# EAGLE design ESP Breakout Adapter - v3.1A - AS1363 - Mini (EAGLE 7.3.0)
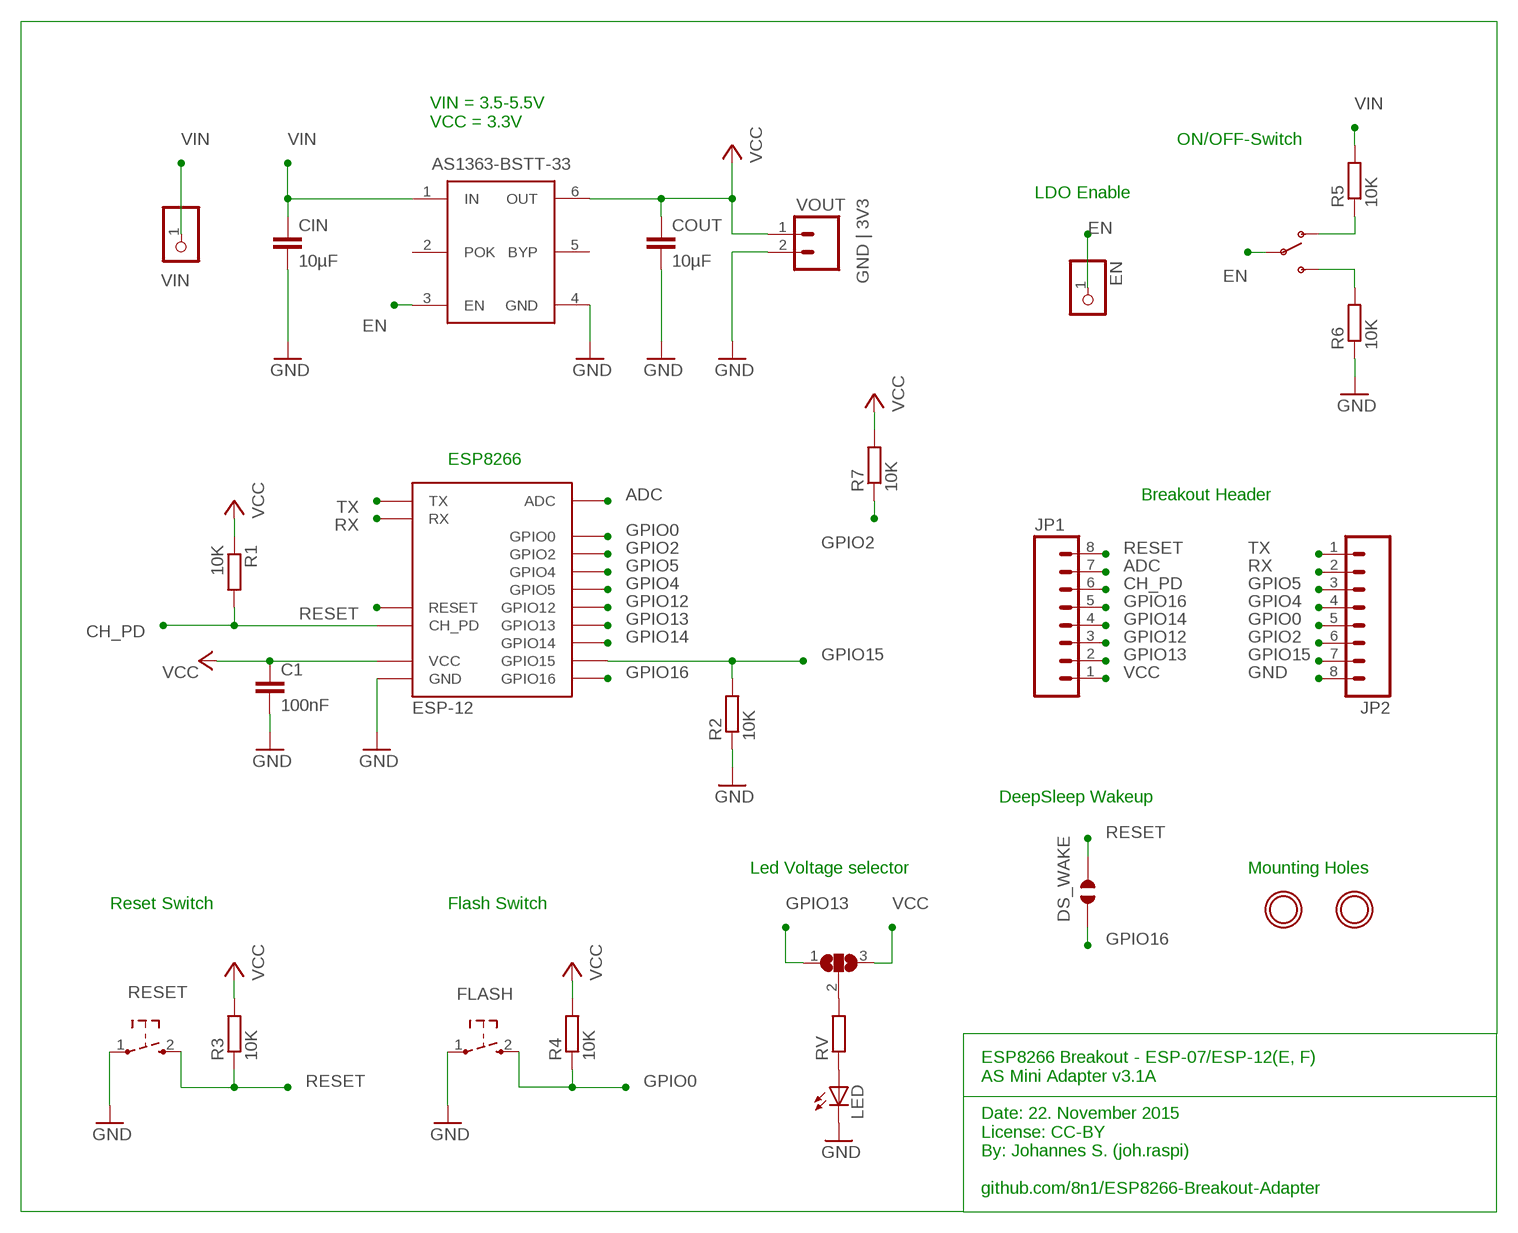
[diagram p0: schematic, sheet 1]

## Parts
AS1363-BSTT-33  AS1363  [SOT23-6]
C1  100nF  C-EUC0805  [C0805]
CIN  10µF  C-EUC0805  [C0805]
COUT  10µF  C-EUC0805  [C0805]
DS_WAKE  JUMPER_SOLDER_1X2  [JUMPER_SOLDER_1X2]
EN  PINHD-1X1  [1X01]
FLASH  SW_TACT_2P-3X6  [SW_TACT_3X6]
JP1  M081X08  [1X08]
JP2  M081X08  [1X08]
LED  LEDCHIPLED_0805  [CHIPLED_0805]
LED_VOLTAGE  SJ2W  [SJ_2]
ON/OFF-SWITCH  SWITCH_SPDT  [KPS-1290]
R1  10K  R-EU_R0805  [R0805]
R2  10K  R-EU_R0805  [R0805]
R3  10K  R-EU_R0805  [R0805]
R4  10K  R-EU_R0805  [R0805]
R5  10K  R-EU_R0805  [R0805]
R6  10K  R-EU_R0805  [R0805]
R7  10K  R-EU_R0805  [R0805]
RESET  SW_TACT_2P-3X6  [SW_TACT_3X6]
RV  R-EU_R0805  [R0805]
U$1  ESP-12  [ESP-12]
U$4  MOUNTINGHOLE2.0  [MOUNTINGHOLE_2.0_PLATED]
U$5  MOUNTINGHOLE2.0  [MOUNTINGHOLE_2.0_PLATED]
VIN  M01PTH_2MM  PINHD-1X1CB  [1X01-CLEANBIG]
VOUT  GND | 3V3  M02PTH  [1X02]

## Nets
123: ON/OFF-SWITCH.S R6.2
ADC: JP1.7 U$1.ADC
CH_PD: JP1.6 R1.2 U$1.CH_PD
EN: AS1363-BSTT-33.3(EN) EN.1 ON/OFF-SWITCH.P
GND [a]: AS1363-BSTT-33.4(GND) C1.2 CIN.2 COUT.2 FLASH.1 JP2.8 LED.C R2.1 R6.1 RESET.1 U$1.GND VOUT.2
GPIO0: FLASH.2 JP2.5 R4.1 U$1.GPIO0
GPIO2: JP2.6 R7.1 U$1.GPIO2
GPIO4: JP2.4 U$1.GPIO5
GPIO5: JP2.3 U$1.GPIO4
GPIO12: JP1.3 U$1.GPIO12
GPIO13: JP1.2 LED_VOLTAGE.1 U$1.GPIO13
GPIO14: JP1.4 U$1.GPIO14
GPIO15: JP2.7 R2.2 U$1.GPIO15
GPIO16: DS_WAKE.1 JP1.5 U$1.GPIO16
N$2: LED_VOLTAGE.2 RV.2
N$3: ON/OFF-SWITCH.O R5.1
N$5: LED.A RV.1
RESET: DS_WAKE.2 JP1.8 R3.1 RESET.2 U$1.RESET
RX: JP2.2 U$1.RX
TX: JP2.1 U$1.TX
VCC: AS1363-BSTT-33.6(OUT) C1.1 COUT.1 JP1.1 LED_VOLTAGE.3 R1.1 R3.2 R4.2 R7.2 U$1.VCC VOUT.1
VIN: AS1363-BSTT-33.1(IN) CIN.1 R5.2 VIN.1
Unconnected: AS1363-BSTT-33.2(POK)

## Notes on the sheet
- VIN = 3.5-5.5V
  VCC = 3.3V
- ON/OFF-Switch
- LDO Enable
- ESP8266
- Breakout Header
- DeepSleep Wakeup
- Led Voltage selector | Mounting Holes
- Reset Switch | Flash Switch
- ESP8266 Breakout - ESP-07/ESP-12(E, F)
  AS Mini Adapter v3.1A
  
  Date: 22. November 2015
  License: CC-BY
  By: Johannes S. (joh.raspi)
  
  github.com/8n1/ESP8266-Breakout-Adapter

## Power pins joined to a net without a drawn wire
BYP: AS1363-BSTT-33.5(BYP)

## Library data of the parts
AS1363-BSTT-33 = joh_as1363:AS1363: 500mA ultra-low-dropout linear regulator 1.2V-5V 40µA quiescen current Source: http://ams.com/eng/content/download/12507/219217/12422
C1 CIN COUT = resistor:C-EU: CAPACITOR, European symbol
DS_WAKE = dp-devices:JUMPER_SOLDER_1X2
EN = pinhead:PINHD-1X1: PIN HEADER
FLASH RESET = dp-devices:SW_TACT_2P
JP1 JP2 = SparkFun:M08: Header 8 Standard 8-pin 0.1" header. Use with straight break away headers (SKU : PRT-00116), right angle break away headers (PRT-00553), swiss pins (PRT-00743), machine pins (PRT-00117), and female headers (PRT-00115).
LED = adafruit:LED: LED OSRAM: - CHIPLED LG R971, LG N971, LY N971, LG Q971, LY Q971, LO R971, LY R971 LH N974, LH R974 LS Q976, LO Q976, LY Q976 LO Q996 - Hyper CHIPLED LW Q18S LB Q993, LB Q99A, LB R99A - SideLED LS A670, LO A670, LY A670, LG A670, LP A670 LB A673, LV A673, LT A673, LW A673 LH A674 LY A675 LS A676, LA A676, LO A676, LY A676, LW A676 LS A679, LY A679, LG A679 - Hyper Micro SIDELED® LS Y876, LA Y876, LO Y876, LY Y876 LT Y87S - SmartLED LW L88C, LW L88S LB L89C, LB L89S, LG L890 LS L89K, LO L89K, LY L89K LS L896, LA L896, LO L896, LY L896 - TOPLED LS T670, LO T670, LY T670, LG T670, LP T670 LSG T670, LSP T670, LSY T670, LOP T670, LYG T670 LG T671, LOG T671, LSG T671 LB T673, LV T673, LT T673, LW T673 LH T674 LS T676, LA T676, LO T676, LY T676, LB T676, LH T676, LSB T676, LW T676 LB T67C, LV T67C, LT T67C, LS T67K, LO T67K, LY T67K, LW E67C LS E67B, LA E67B, LO E67B, LY E67B, LB E67C, LV E67C, LT E67C LW T67C LS T679, LY T679, LG T679 LS T770, LO T770, LY T770, LG T770, LP T770 LB T773, LV T773, LT T773, LW T773 LH T774 LS E675, LA E675, LY E675, LS T675 LS T776, LA T776, LO T776, LY T776, LB T776 LHGB T686 LT T68C, LB T68C - Hyper Mini TOPLED® LB M676 - Mini TOPLED Santana® LG M470 LS M47K, LO M47K, LY M47K Source: http://www.osram.convergy.de/
LED_VOLTAGE = jumper:SJ2W: SMD solder JUMPER
ON/OFF-SWITCH = SparkFun-Electromechanical:SWITCH_SPDT: SWCH-10651 Side-actuated SPDT slide switch, as used on the Arduino Pro; PROD_ID: SWCH-10651
R1-R4 R7 = rcl:R-EU_: RESISTOR, European symbol
R5 R6 RV = resistor:R-EU_: RESISTOR, European symbol
U$1 = johs_esp8266_lib_frank_esp12e_mod:ESP-12: ESP8266 Wifi Module ESP-12; DIMENSIONS: 24.0 x 16.0 mm; PINS: 16; PITCH: 0.078" / 2 mm
U$4 U$5 = microbuilder:MOUNTINGHOLE: Mounting Hole For #2 screws (0.086"/2.18mm width, 0.094"/2.4mm hole) use 2.5mm
VIN = adafruit:PINHD-1X1: Pin header 1x1 for 0.1" spacing With round pins
VOUT = SparkFun:M02: Header 2 Standard 2-pin 0.1" header. Use with straight break away headers (SKU : PRT-00116), right angle break away headers (PRT-00553), swiss pins (PRT-00743), machine pins (PRT-00117), and female headers (PRT-00115). Molex polarized connector foot print use with SKU : PRT-08233 with associated crimp pins and housings.

## Net classes
1 a: width 0.203 mm, drill 0.305 mm, clearance 0.203 mm

## Board
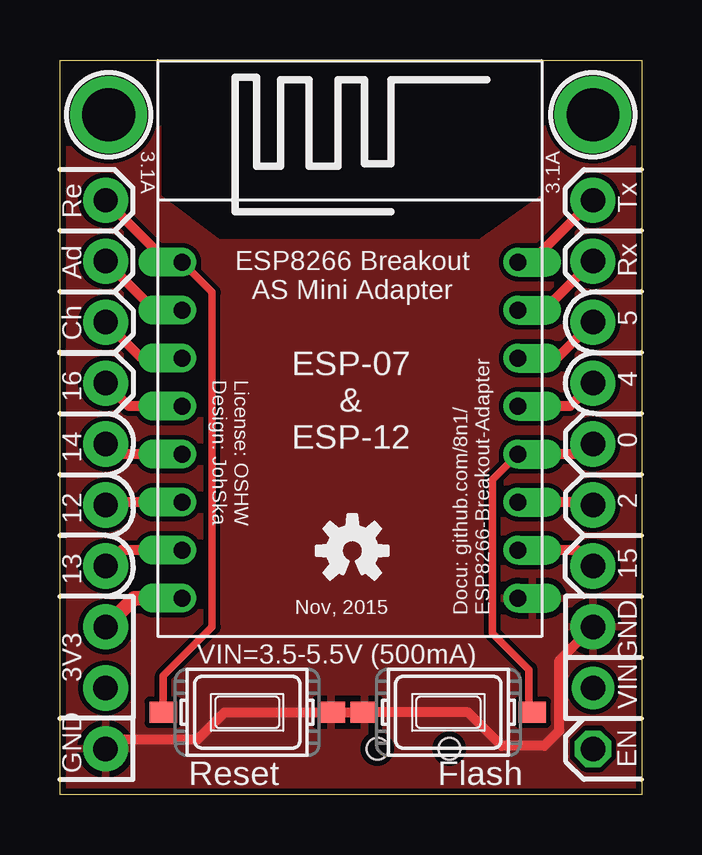
[diagram p1: board, top side]
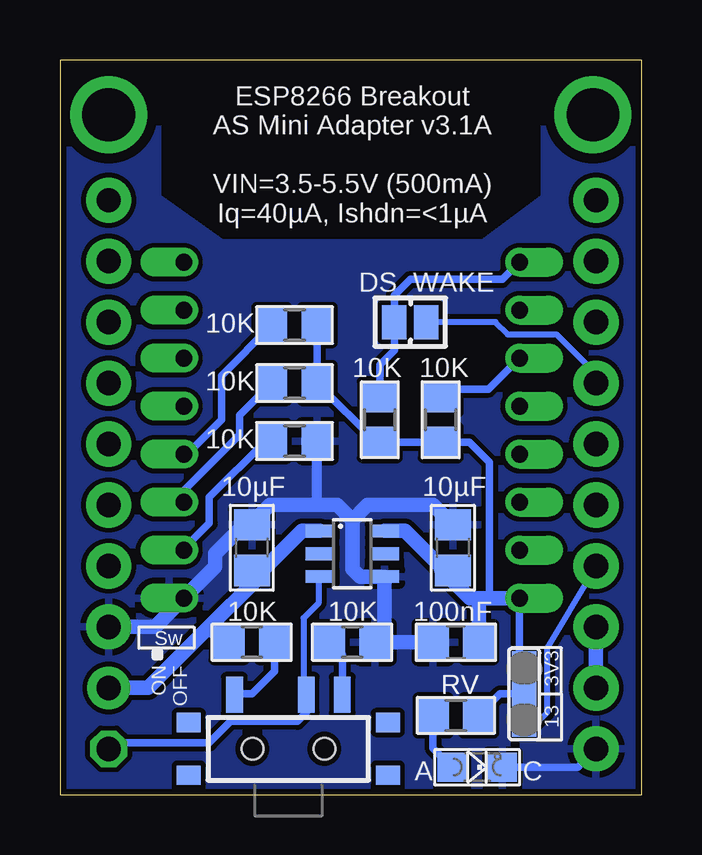
[diagram p2: board, bottom side, seen from below]

Size 24.26 x 30.61 mm. Coordinates in mm from the lower left corner, seen from the top.
Outline: 0,0 0,30.61 24.26,30.61 24.26,0 0,0
Copper layers (1*16): Top 0.035mm / dielectric 1.5mm / Bottom 0.035mm
Design rules "adafruit": minimum track width 10mil, minimum drill 15.5mil, track to track 8mil, track to pad 8mil, pad to pad 8mil, via to via 8mil, smd to smd 8mil, copper to edge 10mil, drill to drill 8mil, minimum pad ring 10mil, minimum via ring 8mil, stop-mask expansion 2mil, vias tented up to drill 20mil, thermal gap 10mil

### Footprints (pad centres in the part's own frame; a part is rotated, then mirrored left to right if it is on the bottom)
SOT23-6 = smd 0.533 x 1.219: 1 -0.95,-1.341; 2 0,-1.341; 3 0.95,-1.341; 4 0.95,1.341; 5 0,1.341; 6 -0.95,1.341
C0805 = smd 1.3 x 1.5: 1 -0.95,0; 2 0.95,0
JUMPER_SOLDER_1X2 = smd 1.016 x 1.422: 1 -0.66,0; 2 0.66,0
1X01 = drill 1.016 octagon: 1 0,0
SW_TACT_3X6 = smd 1.143 x 0.889: 1 -3.5,0; 2 3.5,0
1X08 = drill 1.016 pad 1.88: 1 0,0; 2 2.54,0; 3 5.08,0; 4 7.62,0; 5 10.16,0; 6 12.7,0; 7 15.24,0; 8 17.78,0
CHIPLED_0805 = smd 1.2 x 1.2: A 0,-1.05; C 0,1.05
SJ_2 = smd 1.016 x 1.016: 1 -1.27,0; 2 0,0; 3 1.27,0
KPS-1290 = smd 0.7 x 1.5: O -2.25,2.25; P 0.75,2.25; S 2.25,2.25 | smd 1 x 0.8: P$1 -4.15,1.1; P$2 -4.15,-1.1; P$3 4.15,-1.1; P$4 4.15,1.1 | hole 0.9: -1.5,0; 1.5,0
R0805 = smd 1.3 x 1.5: 1 -0.95,0; 2 0.95,0
ESP-12 = drill 0.7 offset: ADC -7.1,3.8; CH_PD -7.1,1.8; GND 6.9,-8.2; GPIO0 6.9,-2.2; GPIO2 6.9,-4.2; GPIO4 6.9,1.8; GPIO5 6.9,-0.2; GPIO12 -7.1,-4.2; GPIO13 -7.1,-6.2; GPIO14 -7.1,-2.2; GPIO15 6.9,-6.2; GPIO16 -7.1,-0.2; RESET -7.1,5.8; RX 6.9,3.8; TX 6.9,5.8; VCC -7.1,-8.2
MOUNTINGHOLE_2.0_PLATED = drill 2.2 pad 3: P$1 0,0
1X01-CLEANBIG = drill 1.016 pad 1.778: 1 0,0
1X02 = drill 1.016 pad 1.88: 1 0,0; 2 2.54,0

### Placement (x,y rotation side)
AS1363-BSTT-33  12.07,10.03 270 bottom
C1  7.75,6.35 180 bottom
CIN  16.26,10.29 90 bottom
COUT  7.87,10.29 90 bottom
DS_WAKE  9.65,19.69 180 bottom
EN  22.22,1.91 0 top
FLASH  16.19,3.43 0 top
JP1  1.9,6.99 90 top
JP2  22.22,24.77 270 top
LED  6.86,1.14 270 bottom
LED_VOLTAGE  4.9,4.19 90 bottom
ON/OFF-SWITCH  14.73,1.91 0 bottom
R1  8.38,15.62 90 bottom
R2  14.48,14.73 180 bottom
R3  10.92,15.62 270 bottom
R4  14.48,19.56 0 bottom
R5  16.26,6.35 180 bottom
R6  12.07,6.35 180 bottom
R7  14.48,17.14 0 bottom
RESET  7.81,3.43 180 top
RV  7.75,3.3 0 bottom
U$1  12.19,16.38 0 top
U$2  [OSHW-LOGO-S]  12.19,10.16 0 top
U$4  2.03,28.32 0 top
U$5  22.22,28.32 0 top
VIN  22.22,4.45 0 top
VOUT  1.9,4.44 270 top

### Tracks (layer width: path | path; a pad name or v marks a point on that pad's centre or on a via)
123
  Bottom 0.305: ON/OFF-SWITCH.S 12.48,5.82 R6.2
ADC
  Top 0.406: U$1.ADC 3.95,20.18 JP1.7
CH_PD
  Top 0.406: U$1.CH_PD 3.41,18.18 JP1.6
  Bottom 0.305: U$1.CH_PD 6.38,16.89 8.38,16.89 R1.2
EN
  Bottom 0.254: ON/OFF-SWITCH.P 14.11,4.28 14.11,7.35 13.46,8 13.46,9.03 AS1363-BSTT-33.3
  Bottom 0.305: ON/OFF-SWITCH.P 13.97,4.14 13.97,3.43 14.35,3.05 17.14,3.05 18.03,2.16 21.97,2.16 EN.1
GND
  Top 0.305: 12.95,3.51 12.91,3.51
  Top 0.406: JP2.8 20.83,5.59 20.83,2.67 20.19,2.03 18.41,2.03 17.02,3.43 FLASH.1 | 12.91,3.51 12.78,3.51 FLASH.1 | VOUT.2 2.28,2.28 5.71,2.28 6.86,3.43 RESET.1 FLASH.1
  Top 0.61: 20.57,8.25 19.05,8.25 19.09,8.21 U$1.GND
  Bottom 0.254: 13.53,12.13 13.52,12.13 13.46,12.07
  Bottom 0.305: LED.C 2.66,1.14 VOUT.2
  Bottom 0.406: 13.53,12.13 R2.1 13.53,14.42 13.46,14.35 13.46,14.6 13.72,14.86 | 8.07,11.43 8.07,11.5
  Bottom 0.61: JP2.8 20.29,6.99 U$1.GND 17.78,9.49 17.78,10.03 16.58,11.24 CIN.2 16.19,11.24 16.26,11.3 15.49,12.07 13.46,12.07 12.7,12.07 12.07,11.43 | 12.07,11.43 11.43,12.07 8.71,12.07 COUT.2 8.07,11.43 | 12.07,11.43 12.07,9.4 11.75,9.08 AS1363-BSTT-33.4 10.72,6.74 R6.1 C1.2
  pour Bottom: 0.13,0 24.13,0 24.13,30.48 20.19,30.48 20.19,24.89 17.53,22.99 6.6,22.99 4.06,24.89 4.06,30.48 0.13,30.48
  pour Top: 0.13,0 24.13,0 24.13,30.48 20.19,30.48 20.19,24.89 17.53,22.99 6.6,22.99 4.06,24.89 4.06,30.48 0.13,30.48
GPIO0
  Top 0.305: U$1.GPIO0 18.03,13.12 18.03,6.73 19.56,5.21 19.56,3.56 FLASH.2
  Top 0.406: JP2.5 21.8,14.18 U$1.GPIO0
  Bottom 0.305: U$1.GPIO0 18.96,14.18 17.53,15.62 17.53,17.46 R4.1
GPIO2
  Top 0.406: JP2.6 22.11,12.18 U$1.GPIO2
  Bottom 0.305: U$1.GPIO2 19.09,12.66 16.76,14.99 16.76,15.81 R7.1
GPIO4
  Top 0.406: JP2.4 21.26,16.18 U$1.GPIO5
GPIO5
  Top 0.406: JP2.3 20.72,18.18 U$1.GPIO4
GPIO12
  Top 0.406: U$1.GPIO12 2.02,12.18 JP1.3
GPIO13
  Top 0.406: U$1.GPIO13 2.56,10.18 JP1.2
  Bottom 0.254: JP1.2 1.9,9.4 2.03,9.27 3.94,6.1 3.94,3.43 4.45,2.92 LED_VOLTAGE.1
GPIO14
  Top 0.406: U$1.GPIO14 2.33,14.18 JP1.4
GPIO15
  Top 0.406: JP2.7 21.57,10.18 U$1.GPIO15
  Bottom 0.305: U$1.GPIO15 19.09,10.24 18.03,11.3 18.03,12.38 15.68,14.73 R2.2
GPIO16
  Top 0.406: U$1.GPIO16 2.87,16.18 JP1.5
  Bottom 0.254: JP1.5 1.9,17.53 3.56,19.18 5.59,19.18 6.1,19.69 DS_WAKE.1
N$2
  Bottom 0.305: RV.2 5.91,4.19 LED_VOLTAGE.2
N$3
  Bottom 0.305: R5.1 15.31,5.14 16.26,4.19 16.95,4.19 ON/OFF-SWITCH.O
N$5
  Bottom 0.305: 7.87,1.18 LED.A 8.7,1.93 RV.1
RESET
  Top 0.305: U$1.RESET 6.35,20.93 6.35,6.99 4.31,4.95 RESET.2
  Top 0.406: U$1.RESET 4.49,22.18 JP1.8
  Bottom 0.305: U$1.RESET 5.81,21.46 9.65,21.46 10.31,20.8 DS_WAKE.2 10.31,18.52 10.92,17.91 R3.1
RX
  Top 0.406: JP2.2 20.18,20.18 U$1.RX
TX
  Top 0.406: JP2.1 19.64,22.18 U$1.TX
VCC
  Top 0.61: 5.03,8.24 U$1.VCC 3.1,8.18 JP1.1
  Bottom 0.305: 6.35,8.18 6.35,13.84 7.18,14.67 R1.1 R3.2 11.05,14.67 R7.2 R4.2 | 5.41,7.87 U$1.VCC | 5.15,8.12 U$1.VCC | LED_VOLTAGE.3 5.09,5.65 U$1.VCC
  Bottom 0.61: JP1.1 VOUT.1 | U$1.VCC 6.35,8.18 6.86,8.18 | 6.86,8.18 7.17,8.18 8.07,9.08 | 8.38,9.52 7.94,9.52 | 8.07,9.08 8.38,9.39 8.38,9.52 | 8.38,9.52 8.42,9.52 9.88,10.98 AS1363-BSTT-33.6 | COUT.1 7.87,9.27 8.07,9.08 | C1.1 6.8,8.12 6.86,8.18
VIN
  Bottom 0.61: VIN.1 20.57,4.45 18.03,6.99 | 18.03,6.99 16.13,8.89 16.13,9.21 CIN.1 15.81,9.34 14.16,10.98 AS1363-BSTT-33.1 | R5.2 17.4,6.35 18.03,6.99

### Text on the board
tPlace: 3.1A | 3.1A | Tx | Re | ESP8266 Breakout / AS Mini Adapter | Rx | Ad | 5 | Ch | 4 | 16 | License: OSHW / Design: JohSka | 0 | 14 | 2 | 12 | 15 | 13 | Nov, 2015 | Docu: github.com/8n1/ / ESP8266-Breakout-Adapter | GND | VIN=3.5-5.5V (500mA) | VIN | 3V3 | EN | Reset | Flash | GND
bPlace: ESP8266 Breakout / AS Mini Adapter v3.1A / / VIN=3.5-5.5V (500mA) / Iq=40µA, Ishdn=<1µA | DS_WAKE | 3V3 | OFF | Sw | ON | 13 | RV | C | A